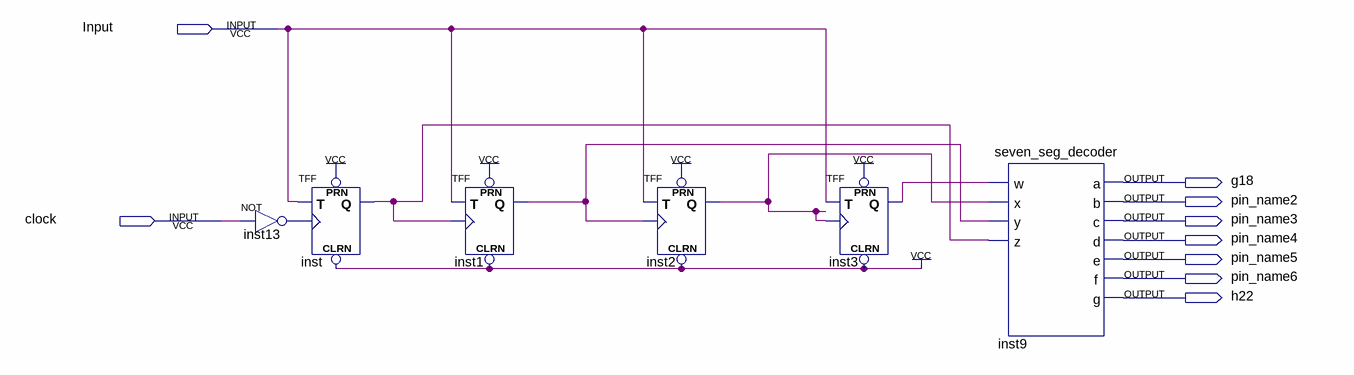
[diagram p0: schematic sheet]
// Quartus schematic lab10step3a.bdf as structural Verilog: 6 symbols, 9 pins
module lab10step3a (
  input  Input,
  input  clock,
  output g18,
  output pin_name2,
  output pin_name3,
  output pin_name4,
  output pin_name5,
  output pin_name6,
  output h22
);

  wire inst1_q, inst2_q, inst3_q, inst13_out, inst_q;

  not inst13 (inst13_out, clock);
  TFF inst (.PRN(1'b1), .CLRN(1'b1), .T(Input), .CLK(inst13_out), .Q(inst_q));
  TFF inst1 (.PRN(1'b1), .CLRN(1'b1), .T(Input), .CLK(inst_q), .Q(inst1_q));
  TFF inst2 (.PRN(1'b1), .CLRN(1'b1), .T(Input), .CLK(inst1_q), .Q(inst2_q));
  TFF inst3 (.PRN(1'b1), .CLRN(1'b1), .T(Input), .CLK(inst2_q), .Q(inst3_q));
  seven_seg_decoder inst9 (
    .w(inst3_q), .x(inst2_q), .y(inst1_q), .z(inst_q), .a(g18), .b(pin_name2), .c(pin_name3), .d(pin_name4),
    .e(pin_name5), .f(pin_name6), .g(h22));
endmodule
